# EAGLE design Enlighten (EAGLE 7.5.0)
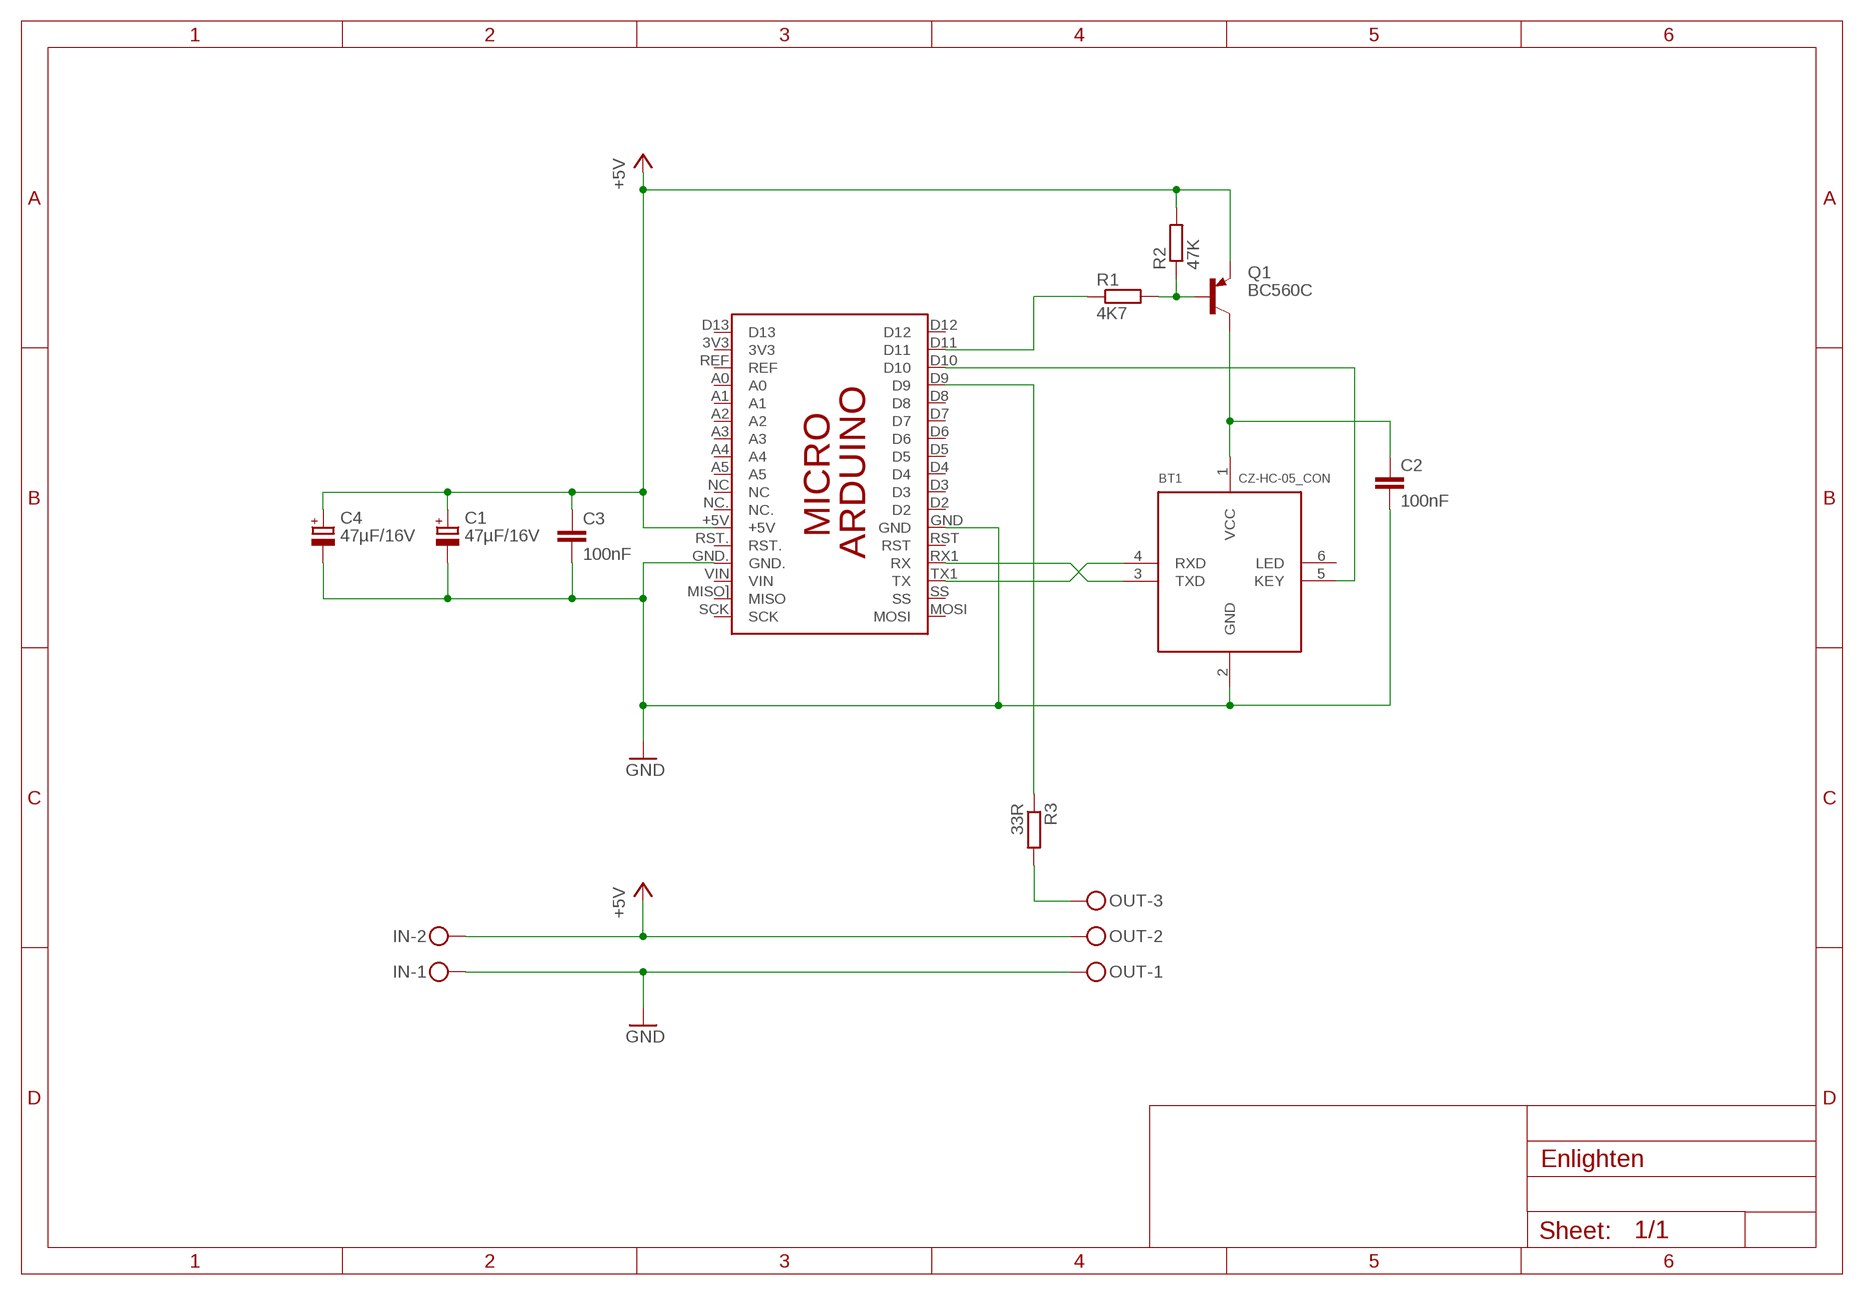
[diagram p0: schematic, sheet 1]

## Parts
BT1  CZ-HC-05_CON  [CZ-HC-05_CON]
C1  47µF/16V  CPOL-EUE2-5  [E2-5]
C2  100nF  C-EU050-024X044  [C050-024X044]
C3  100nF  C-EU050-024X044  [C050-024X044]
C4  47µF/16V  CPOL-EUE2-5  [E2-5]
IN  MKDSN1,5/2-5,08  [MKDSN1,5/2-5,08]
OUT  MKDSN1,5/3-5,08  [MKDSN1,5/3-5,08]
PCB1  ARDUINO_MICRO  [ARDUINO_MICRO]
Q1  BC560C  [TO92-EBC]
R1  4K7  R-EU_0207/10  [0207/10]
R2  47K  R-EU_0207/10  [0207/10]
R3  33R  R-EU_0207/10  [0207/10]

## Nets
+5V: C1.+ C3.1 C4.+ IN.2 OUT.2 PCB1.+5V Q1.E R2.2
BT_KEY: BT1.5(KEY) PCB1.D10
BT_POWER: PCB1.D11 R1.1
BT_RX: BT1.4(RXD) PCB1.TX1(TX)
BT_TX: BT1.3(TXD) PCB1.RX1(RX)
DATA: OUT.3 R3.2
GND: BT1.2(GND) C1.- C2.2 C3.2 C4.- IN.1 OUT.1 PCB1.GND PCB1.GND.
N$5: BT1.1(VCC) C2.1 Q1.C
N$6: Q1.B R1.2 R2.1
N$8: PCB1.D9 R3.1
Unconnected: BT1.6(LED) PCB1.3V3 PCB1.A0 PCB1.A1 PCB1.A2 PCB1.A3 PCB1.A4 PCB1.A5 PCB1.D2 PCB1.D3 PCB1.D4 PCB1.D5 PCB1.D6 PCB1.D7 PCB1.D8 PCB1.D12 PCB1.D13 PCB1.MISO](MISO) PCB1.MOSI PCB1.NC PCB1.NC. PCB1.REF PCB1.RST PCB1.RST. PCB1.SCK PCB1.SS PCB1.VIN

## Library data of the parts
BT1 = Enlighten:CZ-HC-05_CON: HC-05 Bluetooth module with GOMCU baseplate. Version with attached female pin header.
C1 C4 = rcl:CPOL-EU: POLARIZED CAPACITOR, European symbol
C2 C3 = Enlighten:C-EU: CAPACITOR, European symbol
IN = con-phoenix-508:MKDSN1,5/2-5,08: MKDSN 1,5/ 2-5,08 Printklemme Nennstrom: 13,5 A Nennspannung: 250 V Rastermaß: 5,08 mm Polzahl: 2 Anschlussart: Schraubanschluss Montage: Löten Anschlussrichtung Leiter/Platine: 0 ° Artikelnummer: 1729128 Source: http://eshop.phoenixcontact.com .. 1729128.pdf
OUT = con-phoenix-508:MKDSN1,5/3-5,08: MKDSN 1,5/ 3-5,08 Printklemme Nennstrom: 13,5 A Nennspannung: 250 V Rastermaß: 5,08 mm Polzahl: 3 Anschlussart: Schraubanschluss Montage: Löten Anschlussrichtung Leiter/Platine: 0 ° Artikelnummer: 1729131 Source: http://eshop.phoenixcontact.com .. 1729131.pdf
PCB1 = Enlighten:ARDUINO_MICRO: Device for representing an Arduino Micro board with a footprint in an EAGLE design. Created by Dave Young for Element14. More EAGLE documentation at: http://www.element14.com/community/community/knode/cadsoft_eagle
Q1 = Enlighten:BC560*: PNP Transistror
R1-R3 = rcl:R-EU_: RESISTOR, European symbol

## Board
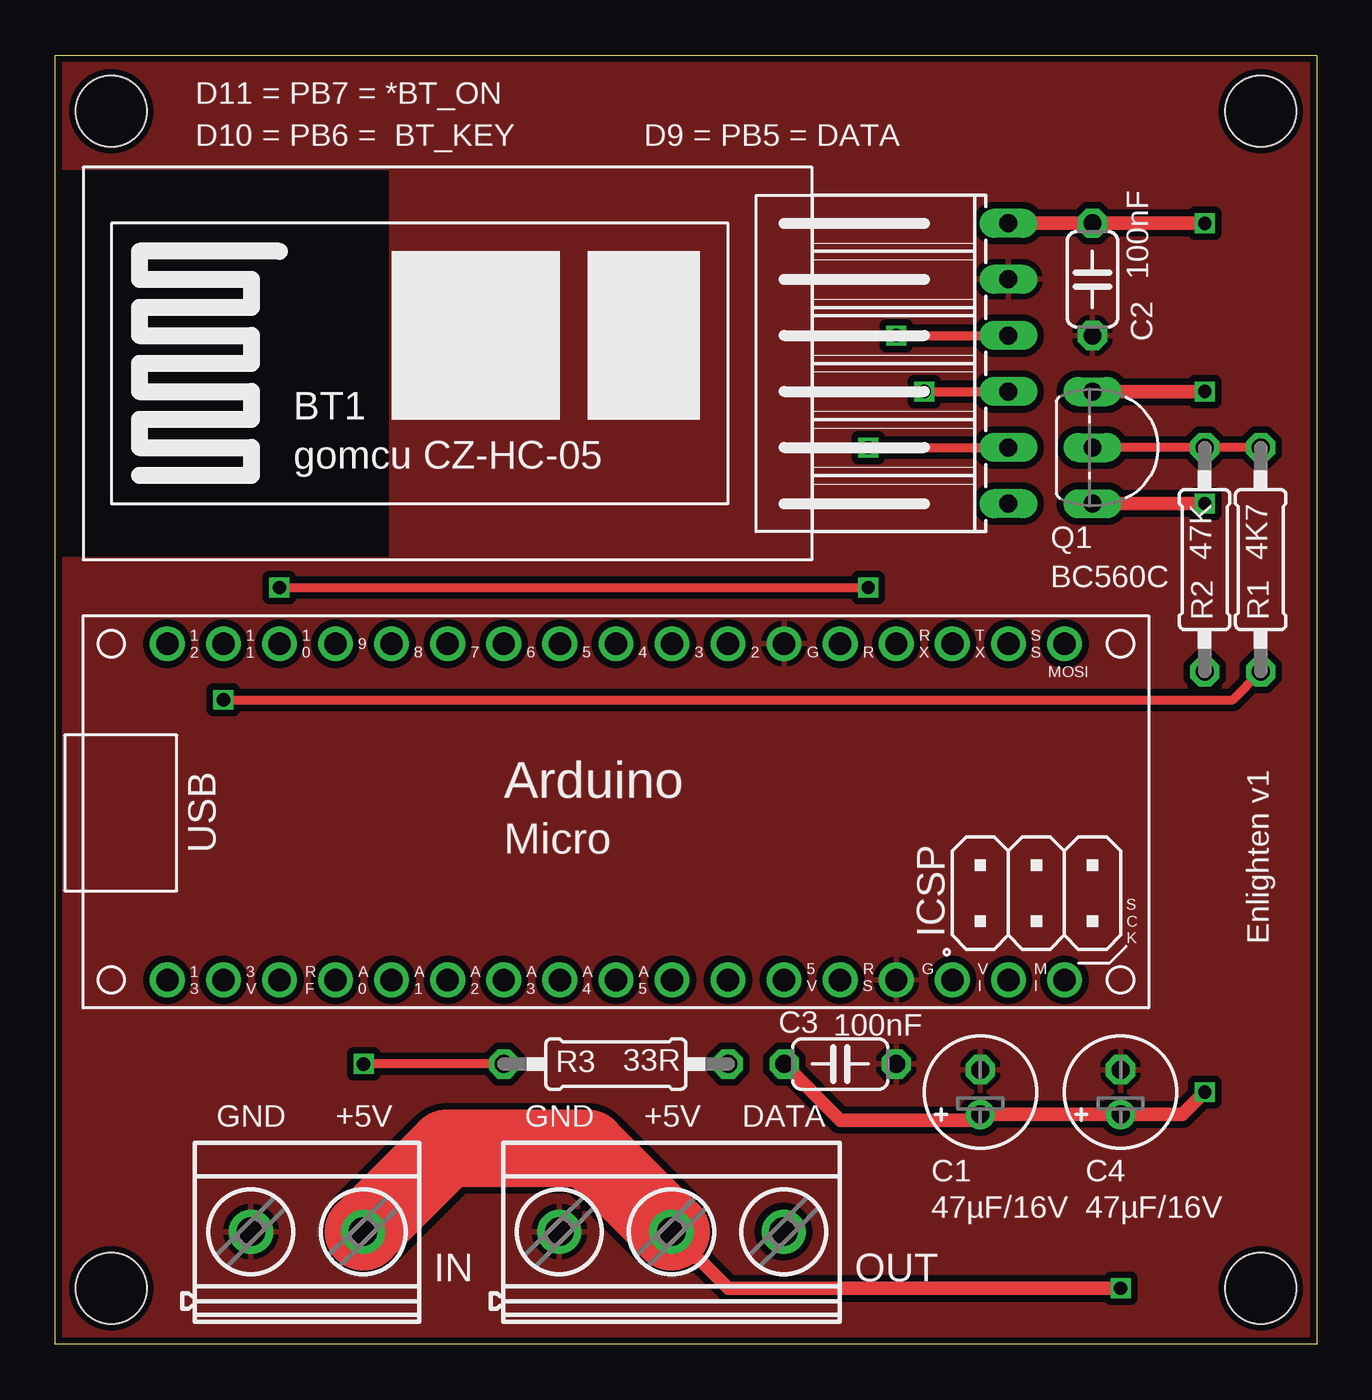
[diagram p1: board, top side]
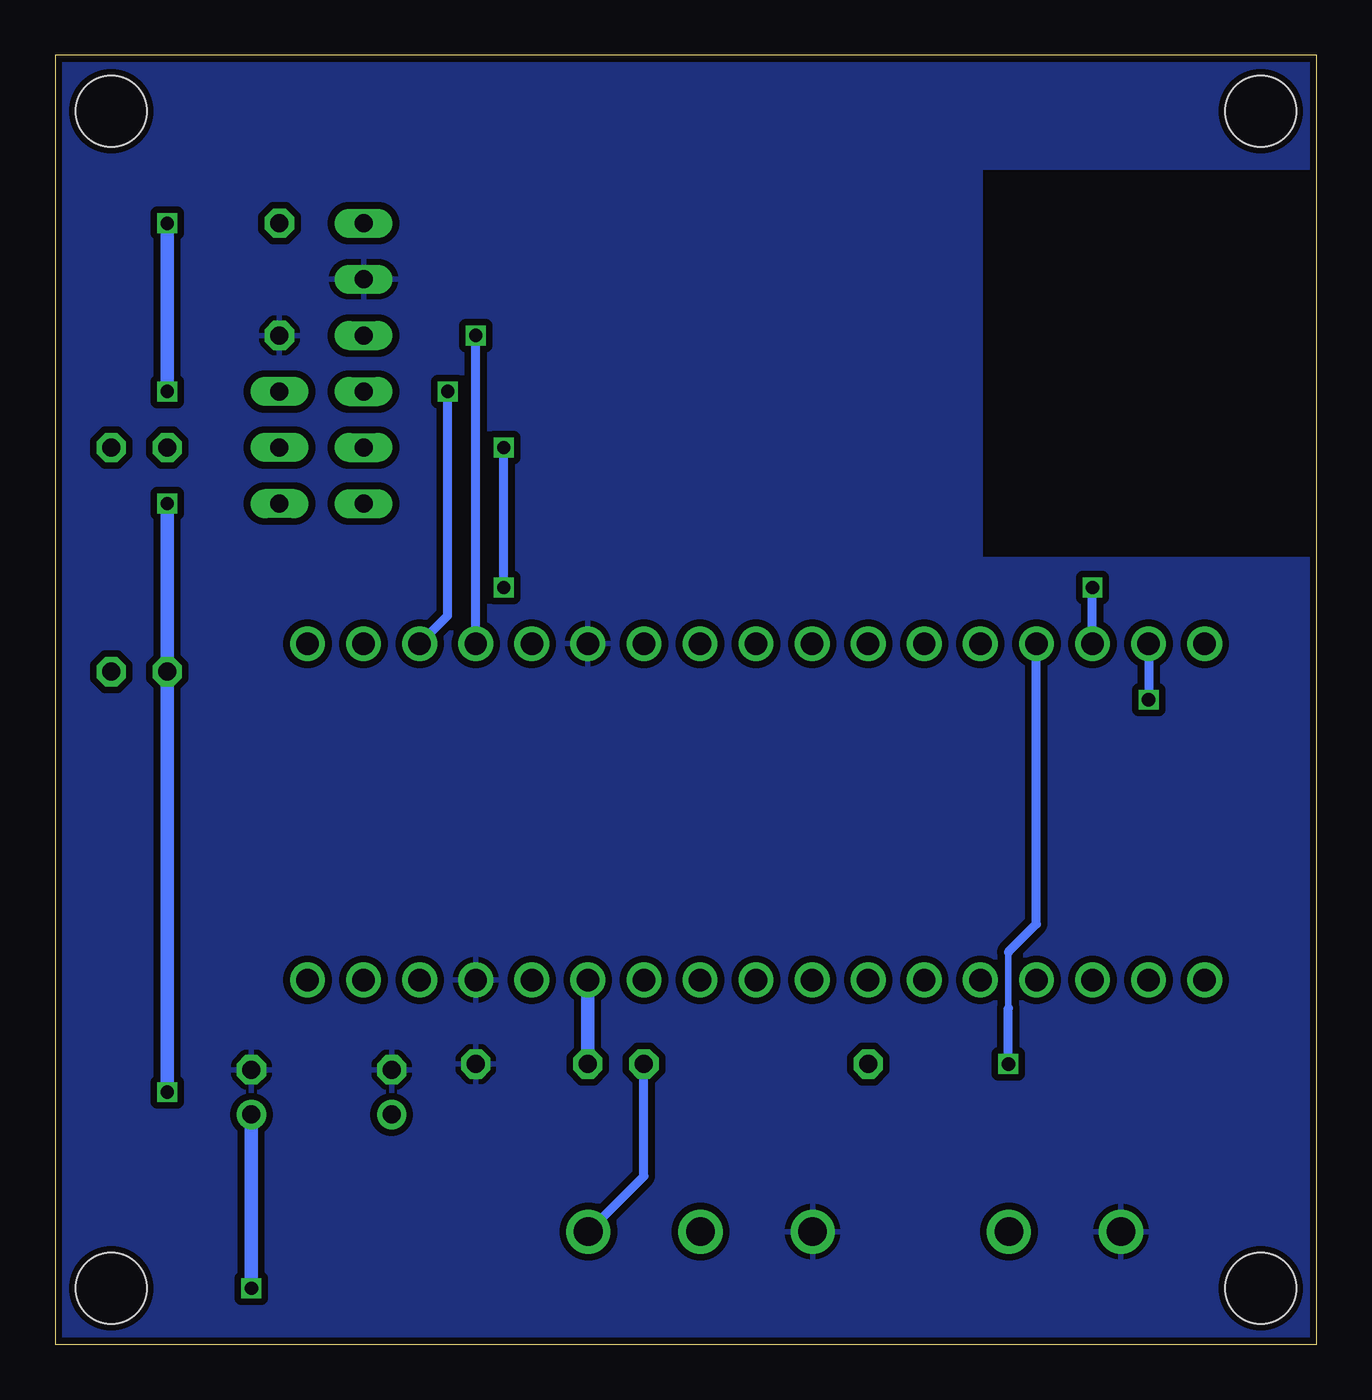
[diagram p2: board, bottom side, seen from below]

Size 57.15 x 58.42 mm. Coordinates in mm from the lower left corner, seen from the top.
Outline: 0,0 0,58.42 57.15,58.42 57.15,0 0,0
Copper layers (1*16): Top 0.035mm / dielectric 1.5mm / Bottom 0.035mm
Design rules "dirt_cheap_dirty_boards.v1": minimum track width 5mil, minimum drill 12mil, track to track 5mil, track to pad 5mil, pad to pad 5mil, via to via 5mil, smd to smd 0mil, copper to edge 10mil, drill to drill 10mil, minimum pad ring 10mil, minimum via ring 6mil, stop-mask expansion 2mil, vias tented up to drill 25mil, thermal gap 10mil
Holes 3.2 mm at 2.54,2.54 2.54,55.88 54.61,55.88 54.61,2.54

### Footprints (pad centres in the part's own frame; a part is rotated, then mirrored left to right if it is on the bottom)
CZ-HC-05_CON = drill 0.813 long: 1 41.91,15.24; 2 41.91,12.7; 3 41.91,10.16; 4 41.91,7.62; 5 41.91,5.08; 6 41.91,2.54
E2-5 = drill 0.813 pad 1.27: + -1.016,0 | drill 0.813 pad 1.27 octagon: - 1.016,0
C050-024X044 = drill 0.813 octagon: 1 -2.54,0; 2 2.54,0
MKDSN1,5/2-5,08 = drill 1.3 pad 2: 1 -2.561,0.025; 2 2.519,0.025
MKDSN1,5/3-5,08 = drill 1.3 pad 2: 1 -7.641,0.025; 2 -2.561,0.025; 3 2.519,0.025
ARDUINO_MICRO = drill 1.016 pad 1.575: 3V3 6.35,1.27; +5V 31.75,1.27; A0 11.43,1.27; A1 13.97,1.27; A2 16.51,1.27; A3 19.05,1.27; A4 21.59,1.27; A5 24.13,1.27; D2 29.21,16.51; D3 26.67,16.51; D4 24.13,16.51; D5 21.59,16.51; D6 19.05,16.51; D7 16.51,16.51; D8 13.97,16.51; D9 11.43,16.51; D10 8.89,16.51; D11 6.35,16.51; D12 3.81,16.51; D13 3.81,1.27; GND 31.75,16.51; GND. 36.83,1.27; MISO] 41.91,1.27; MOSI 44.45,16.51; NC 26.67,1.27; NC. 29.21,1.27; REF 8.89,1.27; RST 34.29,16.51; RST. 34.29,1.27; RX1 36.83,16.51; SCK 44.45,1.27; SS 41.91,16.51; TX1 39.37,16.51; VIN 39.37,1.27
TO92-EBC = drill 0.813 long: B 0,-1.27; C -2.54,-1.27; E 2.54,-1.27
0207/10 = drill 0.813 octagon: 1 -5.08,0; 2 5.08,0

### Placement (x,y rotation side)
BT1  1.27,35.56 0 top
C1  41.91,11.43 90 top
C2  46.99,48.26 270 top
C3  35.56,12.7 0 top
C4  48.26,11.43 90 top
IN  11.43,5.08 0 top
OUT  30.48,5.08 0 top
PCB1  1.27,15.24 0 top
Q1  48.26,40.64 270 top
R1  54.61,35.56 90 top
R2  52.07,35.56 270 top
R3  25.4,12.7 0 top

### Tracks (layer width: path | path; a pad name or v marks a point on that pad's centre or on a via)
+5V  (via drill 0.6)
  Top 0.61: OUT.2 30.48,2.54 v48.26,2.54 | C3.1 35.56,10.16 41.91,10.16 C1.+ C4.+ 51.05,10.41 v52.07,11.43 | v52.07,38.1 Q1.E
  Top 3.5: IN.2 17.73,8.89 24.13,8.89 OUT.2
  Bottom 0.61: v48.26,2.54 C4.+ | C3.1 PCB1.+5V | v52.07,11.43 R2.2 v52.07,38.1
BT_KEY  (via drill 0.6)
  Top 0.406: v10.16,34.29 v36.83,34.29 | v36.83,40.64 BT1.5
  Bottom 0.406: PCB1.D10 v10.16,34.29 | v36.83,34.29 v36.83,40.64
BT_POWER  (via drill 0.6)
  Top 0.406: v7.62,29.21 53.34,29.21 R1.1
  Bottom 0.406: PCB1.D11 v7.62,29.21
BT_RX  (via drill 0.6)
  Top 0.406: v39.37,43.18 BT1.4
  Bottom 0.406: PCB1.TX1 39.37,33.02 v39.37,43.18
BT_TX  (via drill 0.6)
  Top 0.406: v38.1,45.72 BT1.3
  Bottom 0.406: PCB1.RX1 v38.1,45.72
DATA
  Bottom 0.406: OUT.3 30.48,7.62 R3.2
GND
  pour Top (isolate 0.305): 0,0 0,35.56 15.24,35.56 15.24,53.34 0,53.34 0,58.42 57.15,58.42 57.15,0
  pour Bottom (isolate 0.305): 0,0 0,35.56 15.24,35.56 15.24,53.34 0,53.34 0,58.42 57.15,58.42 57.15,0
N$5  (via drill 0.6)
  Top 0.61: Q1.C v52.07,43.18 | v52.07,50.8 C2.1 BT1.1
  Bottom 0.61: v52.07,43.18 v52.07,50.8
N$6
  Top 0.406: R1.2 R2.1 Q1.B
N$8  (via drill 0.6)
  Top 0.406: R3.1 v13.97,12.7
  Bottom 0.305: 13.97,15.24 13.97,17.78
  Bottom 0.406: v13.97,12.7 13.97,15.24 | 13.97,17.78 12.7,19.05 PCB1.D9

### Text on the board
tPlace: D11 = PB7 = *BT_ON | D10 = PB6 = BT_KEY | D9 = PB5 = DATA | 100nF | gomcu CZ-HC-05 | 47K | 4K7 | BC560C | Enlighten v1 | 100nF | 33R | GND | +5V | GND | +5V | DATA | 47µF/16V | 47µF/16V